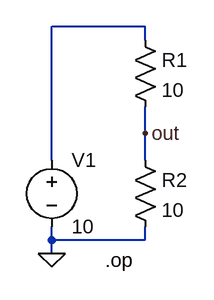
[diagram p0: schematic OP.asc]
OP.asc, the LTspice schematic file:
Version 4
SHEET 1 880 680
WIRE 160 32 48 32
WIRE 160 48 160 32
WIRE 160 160 160 128
WIRE 48 192 48 32
WIRE 160 192 160 160
WIRE 48 288 48 272
WIRE 160 288 160 272
WIRE 160 288 48 288
WIRE 48 304 48 288
FLAG 160 160 out
FLAG 48 304 0
SYMBOL res 144 32 R0
SYMATTR InstName R1
SYMATTR Value 10
SYMBOL res 144 176 R0
SYMATTR InstName R2
SYMATTR Value 10
SYMBOL voltage 48 176 R0
WINDOW 123 0 0 Left 0
WINDOW 39 0 0 Left 0
SYMATTR InstName V1
SYMATTR Value 10
TEXT 112 312 Left 2 !.op

The netlist it stands for:
* OP.asc
R1 N001 out 10
R2 out 0 10
V1 N001 0 10
.op
.backanno
.end